# Altium schematic sheet Vesta_cape.SchDoc: Vesta cape 1
size A3
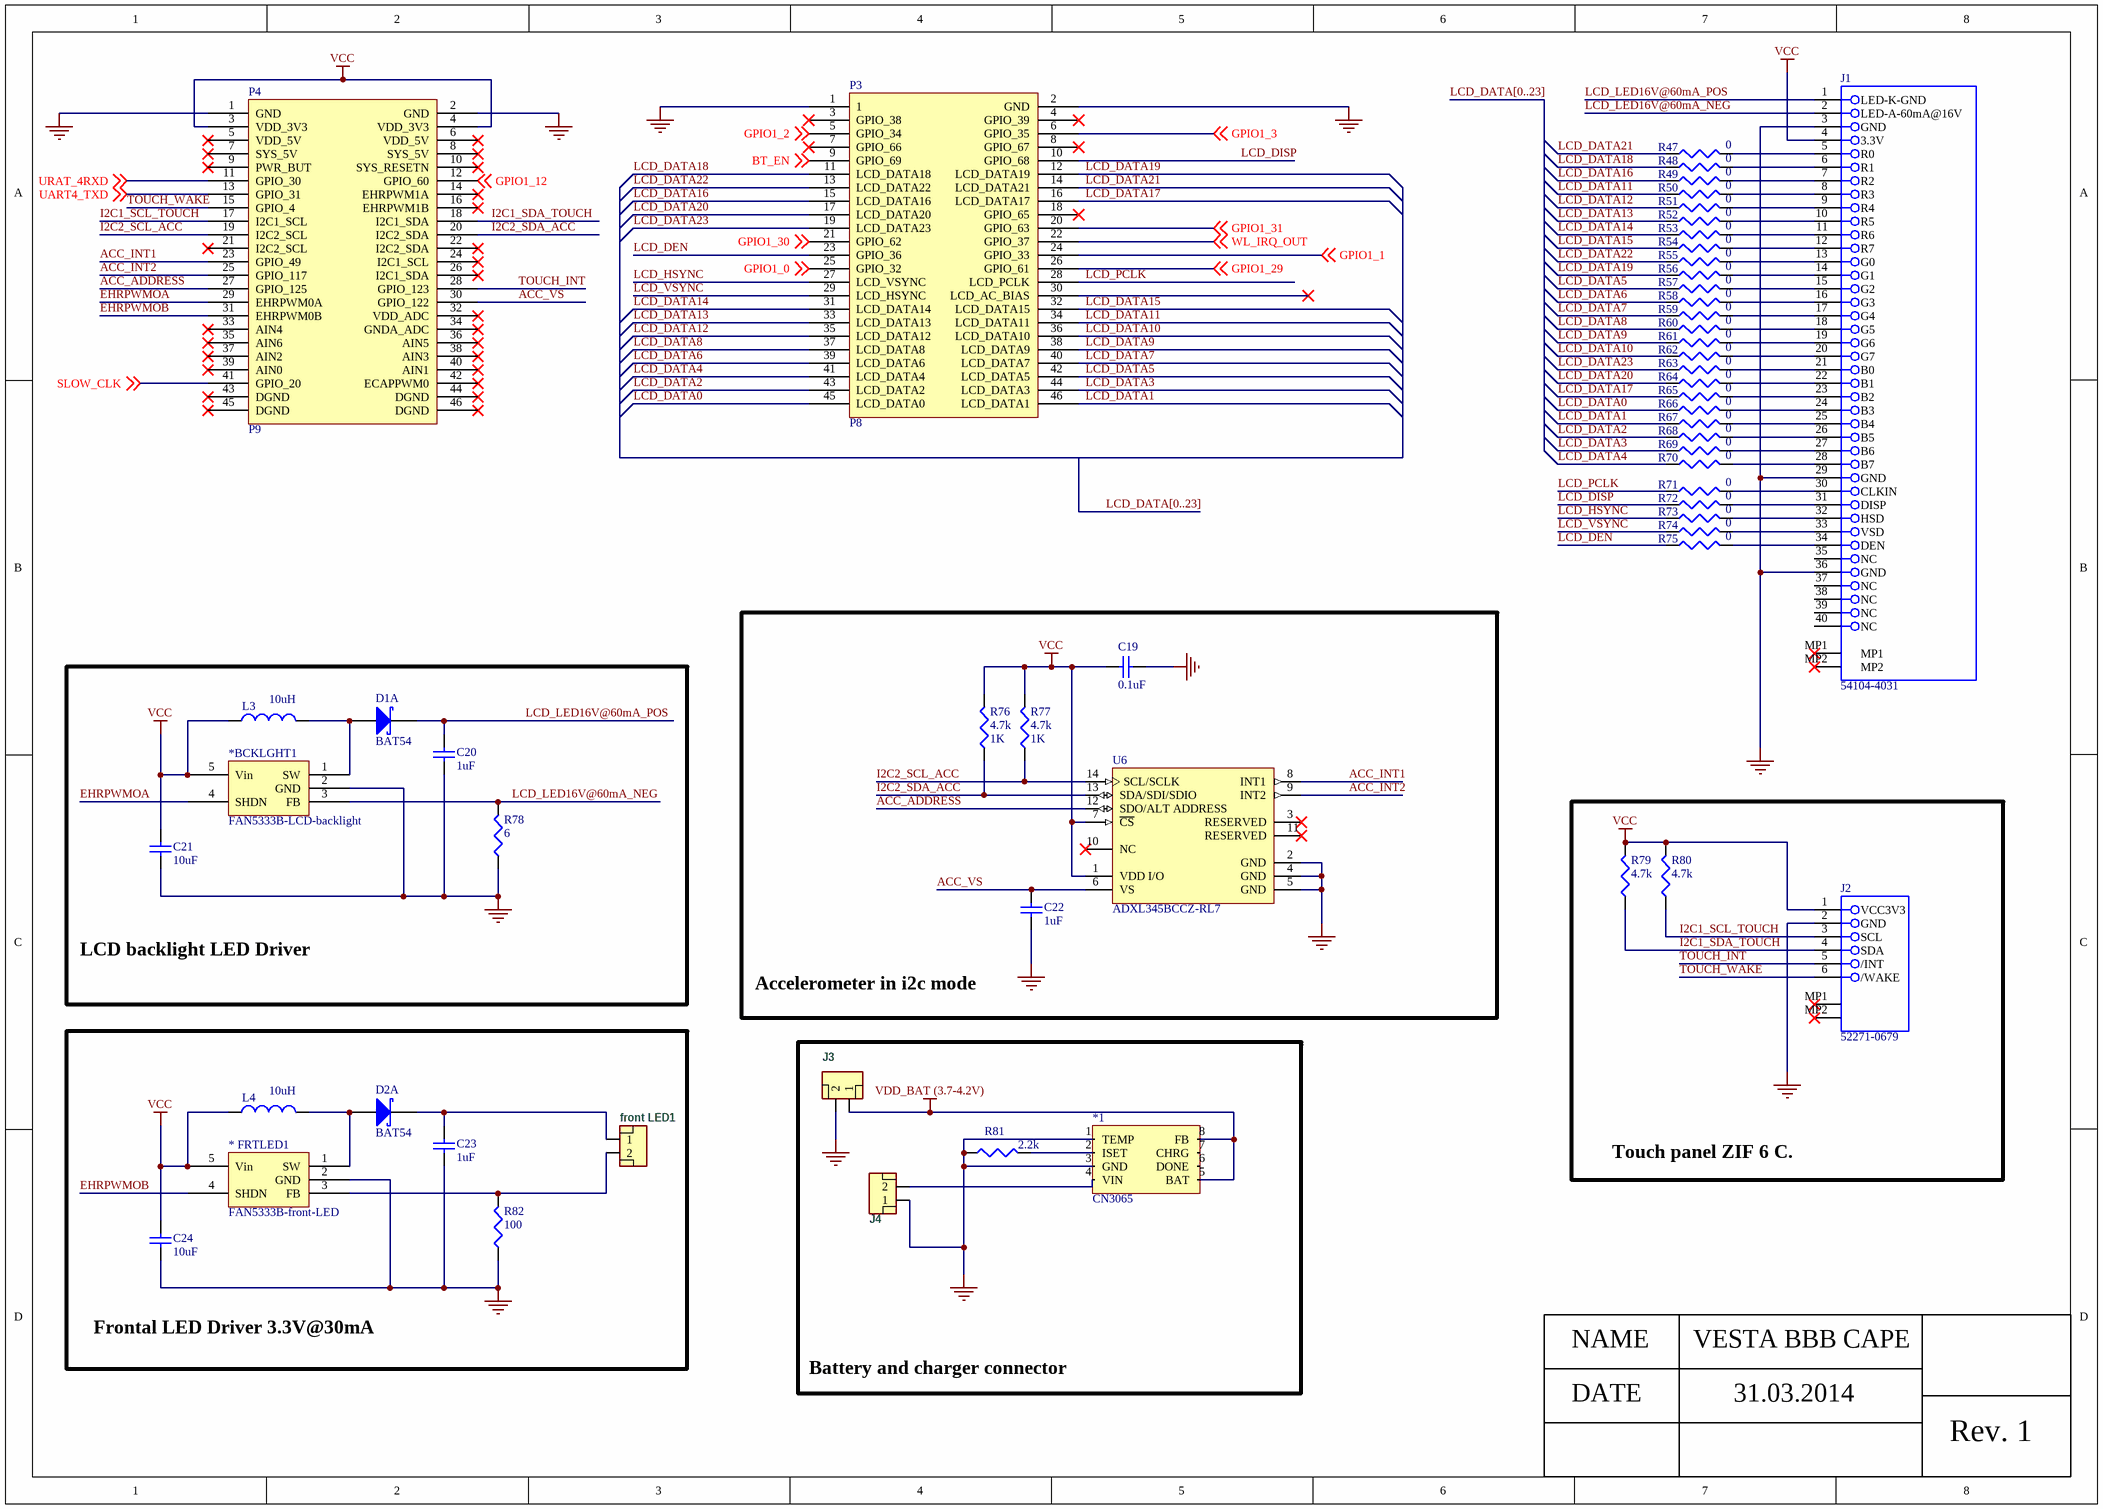
[diagram p0: Vesta_cape.SchDoc]

## Parts
*1  CN3065  [CN3065-LIPO]
*_FRTLED1  FAN5333B-front-LED  [FAN5333A]
*BCKLGHT1  FAN5333B-LCD-backlight  [FAN5333A]
C19  0.1uF  [C1206]
C20  1uF  [C1206]
C21  10uF  [C1206]
C22  1uF  [C1206]
C23  1uF  [C1206]
C24  10uF  [C1206]
D1  BAT54  [NXP-SOT23-3_V]  (part A of 2)
D2  BAT54  [NXP-SOT23-3_V]  (part A of 2)
front_LED1  (no value)  [JMP1X2-F180_2.54]
J1  54104-4031  [MOLX-54104-4031]
J2  52271-0679  [MOLX-52271-0679]
J3  (no value)  [JMP1X2-F180_2.54]
J4  (no value)  [JMP1X2-F180_2.54]
L3  10uH  [0402-A]
L4  10uH  [0402-A]
P3  P8  [HEADER_23_2_SMD]
P4  P9  [HEADER_23_2_SMD]
R47  0  [J1-0603]
R48  0  [J1-0603]
R49  0  [J1-0603]
R50  0  [J1-0603]
R51  0  [J1-0603]
R52  0  [J1-0603]
R53  0  [J1-0603]
R54  0  [J1-0603]
R55  0  [J1-0603]
R56  0  [J1-0603]
R57  0  [J1-0603]
R58  0  [J1-0603]
R59  0  [J1-0603]
R60  0  [J1-0603]
R61  0  [J1-0603]
R62  0  [J1-0603]
R63  0  [J1-0603]
R64  0  [J1-0603]
R65  0  [J1-0603]
R66  0  [J1-0603]
R67  0  [J1-0603]
R68  0  [J1-0603]
R69  0  [J1-0603]
R70  0  [J1-0603]
R71  0  [J1-0603]
R72  0  [J1-0603]
R73  0  [J1-0603]
R74  0  [J1-0603]
R75  0  [J1-0603]
R76  4.7k  value 1K  [J1-0603]
R77  4.7k  value 1K  [J1-0603]
R78  6  [J1-0603]
R79  4.7k  [J1-0603]
R80  4.7k  [J1-0603]
R81  2.2k  [J1-0603]
R82  100  [J1-0603]
U6  ADXL345BCCZ-RL7  [ADI-CC-14-1_V]

## Nets
GND: *1.1(TEMP) *1.3(GND) *_FRTLED1.2(GND) *BCKLGHT1.2(GND) C19.1 C20.1 C21.1 C22.1 C23.1 C24.1 J1.3(GND) J1.29(GND) J1.36(GND) J2.2(GND) J3.2 J4.1 P3.1 P3.2(GND) P4.1(GND) P4.2(GND) R78.1 R81.1 R82.1 U6.2(GND) U6.4(GND) U6.5(GND)
VCC: *_FRTLED1.5(Vin) *BCKLGHT1.5(Vin) C19.2 C21.2 C24.2 J1.4(3.3V) J2.1(VCC3V3) L3.1 L4.1 P4.3(VDD_3V3) P4.4(VDD_3V3) R76.2 R77.2 R79.2 R80.2 U6.1(VDD_I/O) U6.7(~{CS})
VDD_BAT (3.7-4.2V): *1.5(BAT) *1.8(FB) J3.1
ACC_ADDRESS: P4.27(GPIO_125) U6.12(SDO/ALT_ADDRESS)
ACC_INT1: P4.23(GPIO_49) U6.8(INT1)
ACC_INT2: P4.25(GPIO_117) U6.9(INT2)
ACC_VS: C22.2 P4.30(GPIO_122) U6.6(VS)
BT_EN: P3.9(GPIO_69) ; off-sheet BT_EN
EHRPWMOA: *BCKLGHT1.4(SHDN) P4.29(EHRPWM0A)
EHRPWMOB: *_FRTLED1.4(SHDN) P4.31(EHRPWM0B)
GPIO1_0: P3.25(GPIO_32) ; off-sheet GPIO1_0
GPIO1_1: P3.24(GPIO_33) ; off-sheet GPIO1_1
GPIO1_2: P3.5(GPIO_34) ; off-sheet GPIO1_2
GPIO1_3: P3.6(GPIO_35) ; off-sheet GPIO1_3
GPIO1_12: P4.12(GPIO_60) ; off-sheet GPIO1_12
GPIO1_29: P3.26(GPIO_61) ; off-sheet GPIO1_29
GPIO1_30: P3.21(GPIO_62) ; off-sheet GPIO1_30
GPIO1_31: P3.20(GPIO_63) ; off-sheet GPIO1_31
I2C1_SCL_TOUCH: J2.3(SCL) P4.17(I2C1_SCL) R80.1
I2C1_SDA_TOUCH: J2.4(SDA) P4.18(I2C1_SDA) R79.1
I2C2_SCL_ACC: P4.19(I2C2_SCL) R77.1 U6.14(SCL/SCLK)
I2C2_SDA_ACC: P4.20(I2C2_SDA) R76.1 U6.13(SDA/SDI/SDIO)
LCD_DATA0: P3.45(LCD_DATA0) R66.1
LCD_DATA1: P3.46(LCD_DATA1) R67.1
LCD_DATA2: P3.43(LCD_DATA2) R68.1
LCD_DATA3: P3.44(LCD_DATA3) R69.1
LCD_DATA4: P3.41(LCD_DATA4) R70.1
LCD_DATA5: P3.42(LCD_DATA5) R57.1
LCD_DATA6: P3.39(LCD_DATA6) R58.1
LCD_DATA7: P3.40(LCD_DATA7) R59.1
LCD_DATA8: P3.37(LCD_DATA8) R60.1
LCD_DATA9: P3.38(LCD_DATA9) R61.1
LCD_DATA10: P3.36(LCD_DATA10) R62.1
LCD_DATA11: P3.34(LCD_DATA11) R50.1
LCD_DATA12: P3.35(LCD_DATA12) R51.1
LCD_DATA13: P3.33(LCD_DATA13) R52.1
LCD_DATA14: P3.31(LCD_DATA14) R53.1
LCD_DATA15: P3.32(LCD_DATA15) R54.1
LCD_DATA16: P3.15(LCD_DATA16) R49.1
LCD_DATA17: P3.16(LCD_DATA17) R65.1
LCD_DATA18: P3.11(LCD_DATA18) R48.1
LCD_DATA19: P3.12(LCD_DATA19) R56.1
LCD_DATA20: P3.17(LCD_DATA20) R64.1
LCD_DATA21: P3.14(LCD_DATA21) R47.1
LCD_DATA22: P3.13(LCD_DATA22) R55.1
LCD_DATA23: P3.19(LCD_DATA23) R63.1
LCD_DEN: P3.23(GPIO_36) R75.1
LCD_DISP: P3.10(GPIO_68) R72.1
LCD_HSYNC: P3.27(LCD_VSYNC) R73.1
LCD_LED16V@60mA_NEG: *BCKLGHT1.3(FB) J1.2(LED-A-60mA@16V) R78.2
LCD_LED16V@60mA_POS: C20.2 D1.3(K) J1.1(LED-K-GND)
LCD_PCLK: P3.28(LCD_PCLK) R71.1
LCD_VSYNC: P3.29(LCD_HSYNC) R74.1
SLOW_CLK: P4.41(GPIO_20) ; off-sheet SLOW_CLK
TOUCH_INT: J2.5(/INT) P4.28(GPIO_123)
TOUCH_WAKE: J2.6(/WAKE) P4.15(GPIO_4)
UART4_TXD: P4.13(GPIO_31) ; off-sheet UART4_TXD
URAT_4RXD: P4.11(GPIO_30) ; off-sheet URAT_4RXD
WL_IRQ_OUT: P3.22(GPIO_37) ; off-sheet WL_IRQ_OUT
Net*1_2: *1.2(ISET) R81.2
Net*1_4: *1.4(VIN) J4.2
Net*_FRTLED1_1: *_FRTLED1.1(SW) D2.1(A) L4.2
Net*_FRTLED1_3: *_FRTLED1.3(FB) front_LED1.2 R82.2
Net*BCKLGHT1_1: *BCKLGHT1.1(SW) D1.1(A) L3.2
NetC23_2: C23.2 D2.3(K) front_LED1.1
NetJ1_5: J1.5(R0) R47.2
NetJ1_6: J1.6(R1) R48.2
NetJ1_7: J1.7(R2) R49.2
NetJ1_8: J1.8(R3) R50.2
NetJ1_9: J1.9(R4) R51.2
NetJ1_10: J1.10(R5) R52.2
NetJ1_11: J1.11(R6) R53.2
NetJ1_12: J1.12(R7) R54.2
NetJ1_13: J1.13(G0) R55.2
NetJ1_14: J1.14(G1) R56.2
NetJ1_15: J1.15(G2) R57.2
NetJ1_16: J1.16(G3) R58.2
NetJ1_17: J1.17(G4) R59.2
NetJ1_18: J1.18(G5) R60.2
NetJ1_19: J1.19(G6) R61.2
NetJ1_20: J1.20(G7) R62.2
NetJ1_21: J1.21(B0) R63.2
NetJ1_22: J1.22(B1) R64.2
NetJ1_23: J1.23(B2) R65.2
NetJ1_24: J1.24(B3) R66.2
NetJ1_25: J1.25(B4) R67.2
NetJ1_26: J1.26(B5) R68.2
NetJ1_27: J1.27(B6) R69.2
NetJ1_28: J1.28(B7) R70.2
NetJ1_30: J1.30(CLKIN) R71.2
NetJ1_31: J1.31(DISP) R72.2
NetJ1_32: J1.32(HSD) R73.2
NetJ1_33: J1.33(VSD) R74.2
NetJ1_34: J1.34(DEN) R75.2

Not connected (* = marked no-connect by the designer): *1 6(DONE) 7(CHRG); J1 35(NC) 37(NC) 38(NC) 39(NC) 40(NC) MP1* MP2*; J2 MP1* MP2*; P3 3(GPIO_38)* 4(GPIO_39)* 7(GPIO_66)* 8(GPIO_67)* 18(GPIO_65)* 30(LCD_AC_BIAS)*; P4 5(VDD_5V)* 6(VDD_5V)* 7(SYS_5V)* 8(SYS_5V)* 9(PWR_BUT)* 10(SYS_RESETN)* 14(EHRPWM1A)* 16(EHRPWM1B)* 21(I2C2_SCL)* 22(I2C2_SDA)* 24(I2C1_SCL)* 26(I2C1_SDA)* 32(VDD_ADC)* 33(AIN4)* 34(GNDA_ADC)* 35(AIN6)* 36(AIN5)* 37(AIN2)* 38(AIN3)* 39(AIN0)* 40(AIN1)* 42(ECAPPWM0)* 43(DGND)* 44(DGND)* 45(DGND)* 46(DGND)*; U6 3(RESERVED)* 10(NC)* 11(RESERVED)*

## Buses and harness runs
bus LCD_DATA[0..23]

## Notes on the sheet
- LCD backlight LED Driver 16V@60mA
- Accelerometer in i2c mode
- Touch panel ZIF 6 C.
- Frontal LED Driver 3.3V@30mA
- Battery and charger connector
- NAME
- VESTA BBB CAPE
- DATE
- 31.03.2014
- Rev. 1

## Library data of the parts
*_FRTLED1 *BCKLGHT1 = FAN5333B
C19 = Cap Semi: Capacitor (Semiconductor SIM Model); Value: 100pF; Published: 8-Jun-2000; LatestRevisionDate: 29-May-2009; LatestRevisionNote: IPC-7351 Footprint Added.; PackageReference: C1206; Publisher: Altium Limited; PackageDescription: Chip Capacitor
C20 C22 C23 = Cap Semi: Capacitor (Semiconductor SIM Model); Published: 8-Jun-2000; LatestRevisionDate: 29-May-2009; LatestRevisionNote: IPC-7351 Footprint Added.; PackageReference: C1206; Publisher: Altium Limited; PackageDescription: Chip Capacitor; Value: 1uF
C21 C24 = Cap Semi: Capacitor (Semiconductor SIM Model); Value: 100uF; Published: 8-Jun-2000; LatestRevisionDate: 29-May-2009; LatestRevisionNote: IPC-7351 Footprint Added.; PackageReference: C1206; Publisher: Altium Limited; PackageDescription: Chip Capacitor
D1 D2 = CMP-0417-00004-1: Schottky Barrier Diode, 30 V, 2 uA, -55 to 150 degC, 3-Pin SOT23, RoHS, Tape and Reel; Manufacturer: NXP Semiconductors; Cd (pF): 10; Rth(j-a) (K/W): 500; VF (mV): 800; Trr (ns): 5; IR (uA): 2; VR (V): 30; Mounting Technology: Surface Mount; Temperature Range: -55 to 150 degC; Packing: Tape and Reel; PartNumber: BAT54; ComponentLink2Description: Datasheet; PackageReference: SOT23-3; ComponentLink2URL: http://www.nxp.com/documents/data_sheet/BAT54_SER.pdf; RoHS: TRUE; ComponentLink1Description: Manufacturer URL; PackageDescription: 3-Pin Plastic Surface-mounted Package, Body 1.3 x 2.9 mm, Pitch 0.95 mm; ComponentLink1URL: http://www.nxp.com/; PartId: 1
  D2: DatasheetVersion: Rev. 5
front_LED1 = JST-2: =Description
J1 = MOLX-54104-4031: 0.5 mm Pitch Easy-On(TM) Type FPC Connector, 2.0 mm Mated Height, Right Angle, ZIF, SMT, Top Contact, 40 Circuits, -20 to 85 degC, ELV and RoHS Compliant, Tape and Reel; pin to pad: 1>40 2>39 3>38 4>37 5>36 6>35 7>34 8>33 9>32 10>31 11>30 12>29 13>28 14>27 15>26 16>25 17>24 18>23 19>22 20>21 21>20 22>19 23>18 24>17 25>16 26>15 27>14 28>13 29>12 30>11 31>10 32>9 33>8 34>7 35>6 36>5 37>4 38>3 39>2 40>1; Manufacturer: Molex; PCB Retention: Yes; Current (Max per Contact): 0.5A; Stackable: No; Durability (mating cycles max): 20; Pitch - Mating Interface: 0.50mm; Circuits (Loaded): 40; Mated Height: 2.00mm; Entry Angle: 90degrees Angle; Material - Metal: Phosphor Bronze; Voltage (Max): 50V; ComponentLink3URL: http://www.molex.com/pdm_docs/sd/541044031_sd.pdf; ComponentLink2URL: http://www.molex.com/webdocs/datasheets/pdf/en-us/0541044031_FFC_FPC_CONNECTORS.pdf; Number of Rows: 1; ComponentLink1Description: Manufacturer URL; ComponentLink2Description: Datasheet; Mounting Technology: Surface Mount; ComponentLink1URL: http://www.molex.com/molex/index.jsp; RoHS: TRUE; PackageReference: 54104-4031; Polarized to PCB: Yes; ComponentLink3Description: Package Specification; PackageVersion: Rev. F, 06/2012; PackageDescription: 40-Lead FPC Connector, Pitch 0.5 mm; Contact Position: Top; PCB Locator: No; PartNumber: 54104-4031; Orientation: Right Angle; Packing: Tape and Reel
J2 = MOLX-52271-0679: 1.0 mm Pitch Easy-On(TM) Type FPC Connector, 3.0 mm Mated Height, Right Angle, ZIF, SMT, Bottom Contact, 6 Circuits, -40 to 85 degC, ELV and RoHS Compliant, Tape and Reel; Manufacturer: Molex; Material - Plating Termination: Tin-Bismuth; Pitch - Mating Interface: 1.00mm; Voltage (Max): 50V AC (RMS)/DC; Durability (mating cycles max): 30; Mated Height: 3.00mm; PCB Locator: No; Polarized to PCB: Yes; Material - Metal: Phosphor Bronze; Current (Max per Contact): 0.5A; Circuits (Loaded): 6; Entry Angle: 90degrees Angle; ComponentLink1Description: Manufacturer URL; PackageVersion: Rev. B, 04/2004; PackageDescription: 6-Lead FPC Connector, Pitch 1.0 mm; Packing: Tape and Reel; Contact Position: Bottom; Material - Plating Mating: Tin-Bismuth; PackageReference: 52271-0679; RoHS: TRUE; ComponentLink2Description: Datasheet; ComponentLink1URL: http://www.molex.com/molex/index.jsp; PartNumber: 52271-0679; Pitch - Termination Interface: 1.00mm; ComponentLink3URL: http://www.molex.com/pdm_docs/sd/522710679_sd.pdf; Orientation: Right Angle; Number of Rows: 1; Stackable: No; PCB Retention: Yes; Mounting Technology: Surface Mount; ComponentLink3Description: Package Specification; ComponentLink2URL: http://www.molex.com/webdocs/datasheets/pdf/en-us/0522710679_FFC_FPC_CONNECTORS.pdf
J3 = JST-2: jst2mm connector
J4 = JST-2: jst 2mm connector
L3 L4 = Inductor: Code_IEC: 1005; Value: 10mH; Published: 8-Jun-2000; LatestRevisionDate: 29-May-2009; LatestRevisionNote: IPC-7351 Footprint Added.; PackageReference: 0402-A; Publisher: Altium Limited; PackageDescription: Chip Inductor; Code_JEITA: 0402
P3 = HDR_2_23_M_P8: BBB-P8
P4 = HDR2-23-M-P9: BBB-P9
R47-R75 = Res3: Resistor; Value: 0K; Published: 8-Jun-2000; LatestRevisionDate: 29-May-2009; LatestRevisionNote: IPC-7351 Footprint Added.; PackageReference: J1-0603; Publisher: Altium Limited; PackageDescription: Chip Resistor
R76 R77 R79 R80 R82 = Res3: Resistor; Published: 8-Jun-2000; LatestRevisionDate: 29-May-2009; LatestRevisionNote: IPC-7351 Footprint Added.; PackageReference: J1-0603; Publisher: Altium Limited; PackageDescription: Chip Resistor
  R79 R80: Value: 4.7k
  R82: Value: 100
R78 = Res3: Resistor; Value: 1K; Published: 8-Jun-2000; LatestRevisionDate: 29-May-2009; LatestRevisionNote: IPC-7351 Footprint Added.; PackageReference: J1-0603; Publisher: Altium Limited; PackageDescription: Chip Resistor
R81 = Res3: Resistor; Value: 2K; Published: 8-Jun-2000; LatestRevisionDate: 29-May-2009; LatestRevisionNote: IPC-7351 Footprint Added.; PackageReference: J1-0603; Publisher: Altium Limited; PackageDescription: Chip Resistor
U6 = CMP-0885-00033-1: 3-Axis, +/-2 g / +/-4 g / +/-8 g / +/-16 g Digital Accelerometer with Digital Output, 1.6 KHz BW, Industrial, 14-pin LGA, Reel; Manufacturer: Analog Devices; Supply Current: 140 uA; Voltage Supply (V): 2.0 to 3.6; -3dB Bandwidth: 1.6 KHz; Sensitivity: 256/128/64/32 LSB/g; # of Axes: 3; Output Type: Digital; PackageDescription: 14-Pin Land Grid Array, 3 x 5 mm Body, 0.8 mm Pitch; ComponentLink1URL: http://www.analog.com/en/index.html; ComponentLink2Description: Datasheet; PartNumber: ADXL345BCCZ-RL7; ComponentLink3Description: Package Specification; ComponentLink4URL: http://www.analog.com/en/mems-sensors/mems-inertial-sensors/adxl345/products/product.html; PackageVersion: 03-16-2010-A, 03/2010; ComponentLink1Description: Manufacturer URL; ComponentLink2URL: http://www.analog.com/static/imported-files/data_sheets/ADXL345.pdf; DatasheetVersion: Rev. D; PackageReference: CC-14-1; Packing: Reel; Mounting Technology: Surface Mount; ComponentLink4Description: Product URL; ComponentLink3URL: http://www.analog.com/static/imported-files/data_sheets/ADXL343.pdf